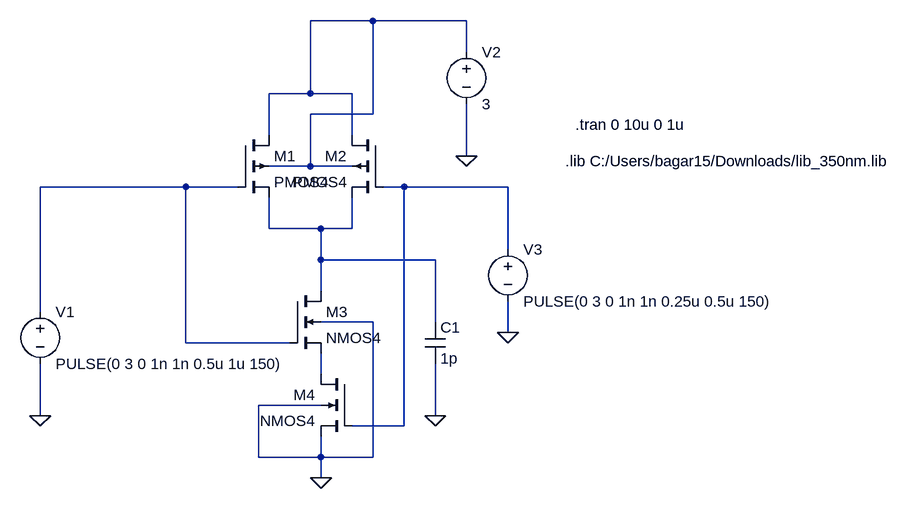
[diagram p0: schematic obvod2.asc]
obvod2.asc, the LTspice schematic file:
Version 4
SHEET 1 880 680
WIRE 48 -144 -48 -144
WIRE 192 -144 48 -144
WIRE 192 -96 192 -144
WIRE -48 -32 -48 -144
WIRE -48 -32 -112 -32
WIRE 16 -32 -48 -32
WIRE 48 0 48 -144
WIRE 48 0 -48 0
WIRE -112 32 -112 -32
WIRE 16 32 16 -32
WIRE 192 64 192 -16
WIRE -48 80 -48 0
WIRE -48 80 -112 80
WIRE 16 80 -48 80
WIRE -240 112 -464 112
WIRE -160 112 -240 112
WIRE 96 112 64 112
WIRE 256 112 96 112
WIRE -112 176 -112 128
WIRE -32 176 -112 176
WIRE 16 176 16 128
WIRE 16 176 -32 176
WIRE 256 208 256 112
WIRE -32 224 -32 176
WIRE 144 224 -32 224
WIRE -32 272 -32 224
WIRE -464 304 -464 112
WIRE 48 320 -32 320
WIRE 144 320 144 224
WIRE 256 336 256 288
WIRE -240 352 -240 112
WIRE -80 352 -240 352
WIRE -32 400 -32 368
WIRE -32 448 -128 448
WIRE -464 464 -464 384
WIRE 144 464 144 384
WIRE 96 480 96 112
WIRE 96 480 16 480
WIRE -128 528 -128 448
WIRE -32 528 -32 496
WIRE -32 528 -128 528
WIRE 48 528 48 320
WIRE 48 528 -32 528
WIRE -32 560 -32 528
FLAG -464 464 0
FLAG 192 64 0
FLAG 256 336 0
FLAG 144 464 0
FLAG -32 560 0
SYMBOL pmos4 -160 32 R0
SYMATTR InstName M1
SYMATTR Value PMOS4
SYMATTR Value2 l=2u w=90u
SYMBOL pmos4 64 32 M0
SYMATTR InstName M2
SYMATTR Value PMOS4
SYMATTR Value2 l=2u w=90u
SYMBOL voltage -464 288 R0
WINDOW 123 0 0 Left 2
WINDOW 39 0 0 Left 2
SYMATTR InstName V1
SYMATTR Value PULSE(0 3 0 1n 1n 0.5u 1u 150)
SYMBOL voltage 192 -112 R0
WINDOW 123 0 0 Left 2
WINDOW 39 0 0 Left 2
SYMATTR InstName V2
SYMATTR Value 3
SYMBOL voltage 256 192 R0
WINDOW 123 0 0 Left 2
WINDOW 39 0 0 Left 2
SYMATTR InstName V3
SYMATTR Value PULSE(0 3 0 1n 1n 0.25u 0.5u 150)
SYMBOL nmos4 -80 272 R0
SYMATTR InstName M3
SYMATTR Value NMOS4
SYMATTR Value2 l=2u w=30u
SYMBOL nmos4 16 400 M0
SYMATTR InstName M4
SYMATTR Value NMOS4
SYMATTR Value2 l=2u w=30u
SYMBOL cap 128 320 R0
SYMATTR InstName C1
SYMATTR Value 1p
TEXT 344 72 Left 2 !.lib C:/Users/bagar15/Downloads/lib_350nm.lib
TEXT 360 16 Left 2 !.tran 0 10u 0 1u

The netlist it stands for:
* obvod2.asc
M1 N001 N002 N004 N001 PMOS4 l=2u w=90u
M2 N001 N003 N004 N001 PMOS4 l=2u w=90u
V1 N002 0 PULSE(0 3 0 1n 1n 0.5u 1u 150)
V2 N001 0 3
V3 N003 0 PULSE(0 3 0 1n 1n 0.25u 0.5u 150)
M3 N004 N002 N005 0 NMOS4 l=2u w=30u
M4 N005 N003 0 0 NMOS4 l=2u w=30u
C1 N004 0 1p
.model NMOS NMOS
.model PMOS PMOS
.lib standard.mos
.lib C:/Users/bagar15/Downloads/lib_350nm.lib
.tran 0 10u 0 1u
.backanno
.end